# EasyEDA schematic SCH.json
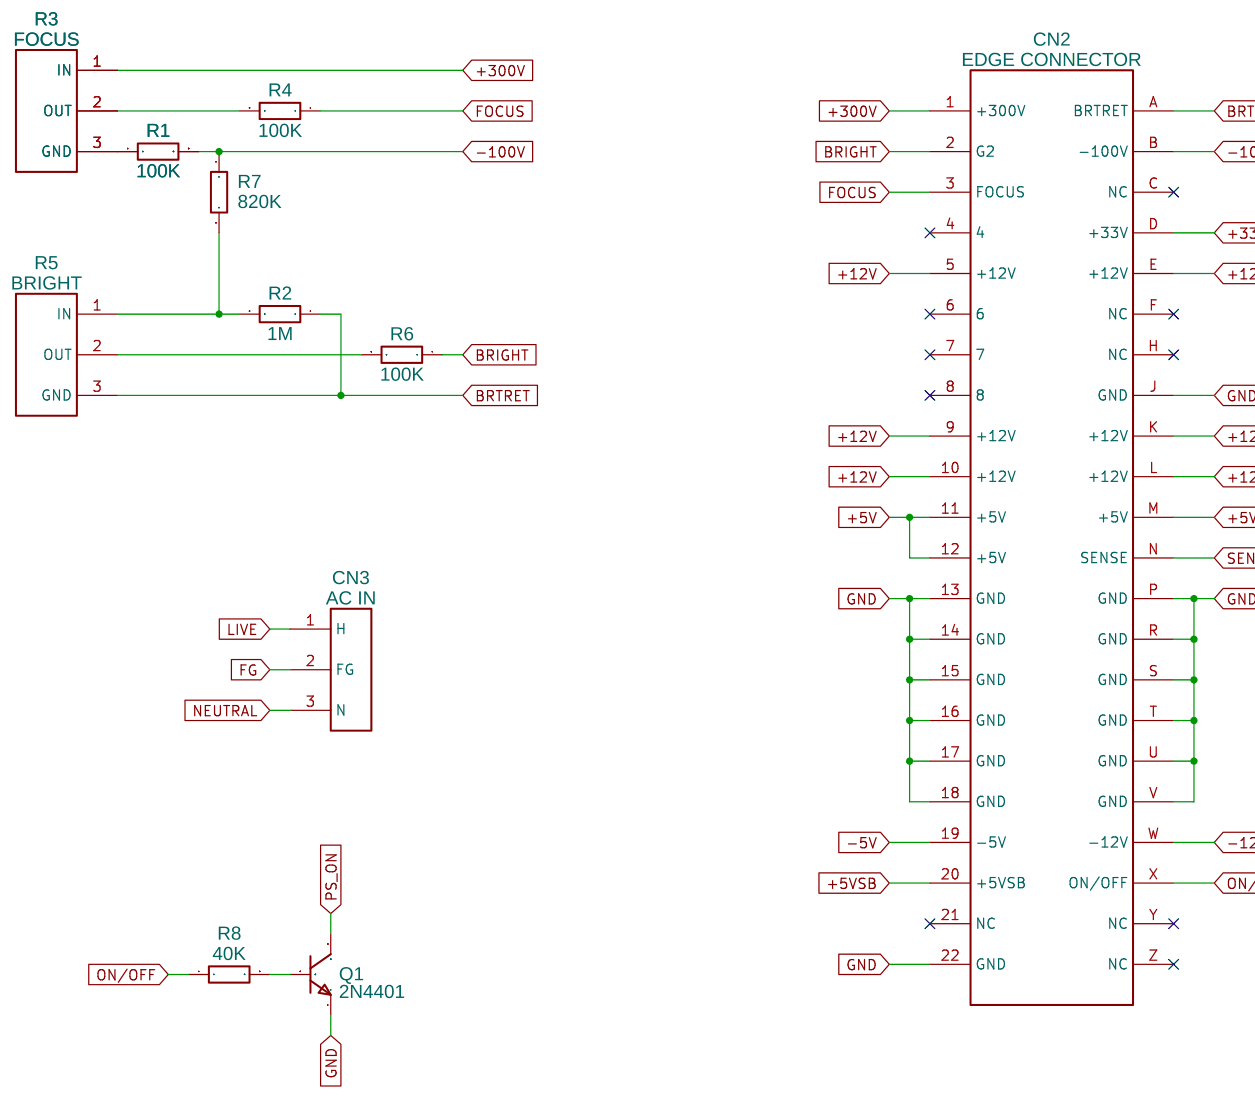
[diagram p0: schematic sheet]

## Parts
CN2  EDGE CONNECTOR  [LISA_PSU_EDGE_CONNECTOR]
CN3  AC IN  [LISA_PSU_AC_IN]
Q1  2N4401  [TO-92-3_L4.9-W3.7-P1.27-L]
R1  100K  [LISA_RESISTOR]
R2  1M  [LISA_RESISTOR]
R3  FOCUS  [LISA_CRT_POT]
R4  100K  [LISA_RESISTOR]
R5  BRIGHT  [LISA_CRT_POT]
R6  100K  [LISA_RESISTOR]
R7  820K  [LISA_RESISTOR]
R8  40K  [LISA_RESISTOR]

## Library data of the parts
CN2 = LISA_PSU_EDGE_CONNECTOR: Contributor: will_tooker
CN3 = LISA_PSU_AC_IN: Contributor: William Tooker
Q1 = 2N4401-C118540: Supplier: LCSC; Manufacturer: ST(先科); Contributor: 立创EDA官方封装库; Supplier Part: C118540; JLCPCB Part Class: Extended Part
R1 R2 R4 R6-R8 = LISA_CPU_RESISTOR: Contributor: William Tooker
R3 R5 = LISA_CRT_POT: Contributor: William Tooker

## Nets
+5V: CN2.11(+5V) CN2.12(+5V) CN2.M(+5V)
+5VSB: CN2.20(+5VSB)
+12V: CN2.5(+12V) CN2.9(+12V) CN2.10(+12V) CN2.E(+12V) CN2.K(+12V) CN2.L(+12V)
+33V: CN2.D(+33V)
+300V: CN2.1(+300V) R3.1(IN)
-5V: CN2.19(-5V)
-12V: CN2.W(-12V)
-100V: CN2.B(-100V) R1.2 R7.1
GND: CN2.13(GND) CN2.14(GND) CN2.15(GND) CN2.16(GND) CN2.17(GND) CN2.18(GND) CN2.22(GND) CN2.J(GND) CN2.P(GND) CN2.R(GND) CN2.S(GND) CN2.T(GND) CN2.U(GND) CN2.V(GND) Q1.1(E)
BRIGHT: CN2.2(G2) R6.1
BRTRET: CN2.A(BRTRET) R2.1 R5.3(GND)
FG: CN3.2(FG)
FOCUS: CN2.3(FOCUS) R4.1
LIVE: CN3.1(H)
NEUTRAL: CN3.3(N)
ON/OFF: CN2.X(ON/OFF) R8.1
PS_ON: Q1.3(C)
SENSE: CN2.N(SENSE)
Net-(Q1-2): Q1.2(B) R8.2
Net-(R1-1): R1.1 R3.3(GND)
Net-(R2-2): R2.2 R5.1(IN) R7.2
Net-(R3-2): R3.2(OUT) R4.2
Net-(R5-2): R5.2(OUT) R6.2

Not connected (* = marked no-connect by the designer): CN2 4* 6* 7* 8* 21(NC)* C(NC)* F(NC)* H(NC)* Y(NC)* Z(NC)*
